# EAGLE design Y187 (EAGLE 6.6.0)

## Sheet 1 of 2
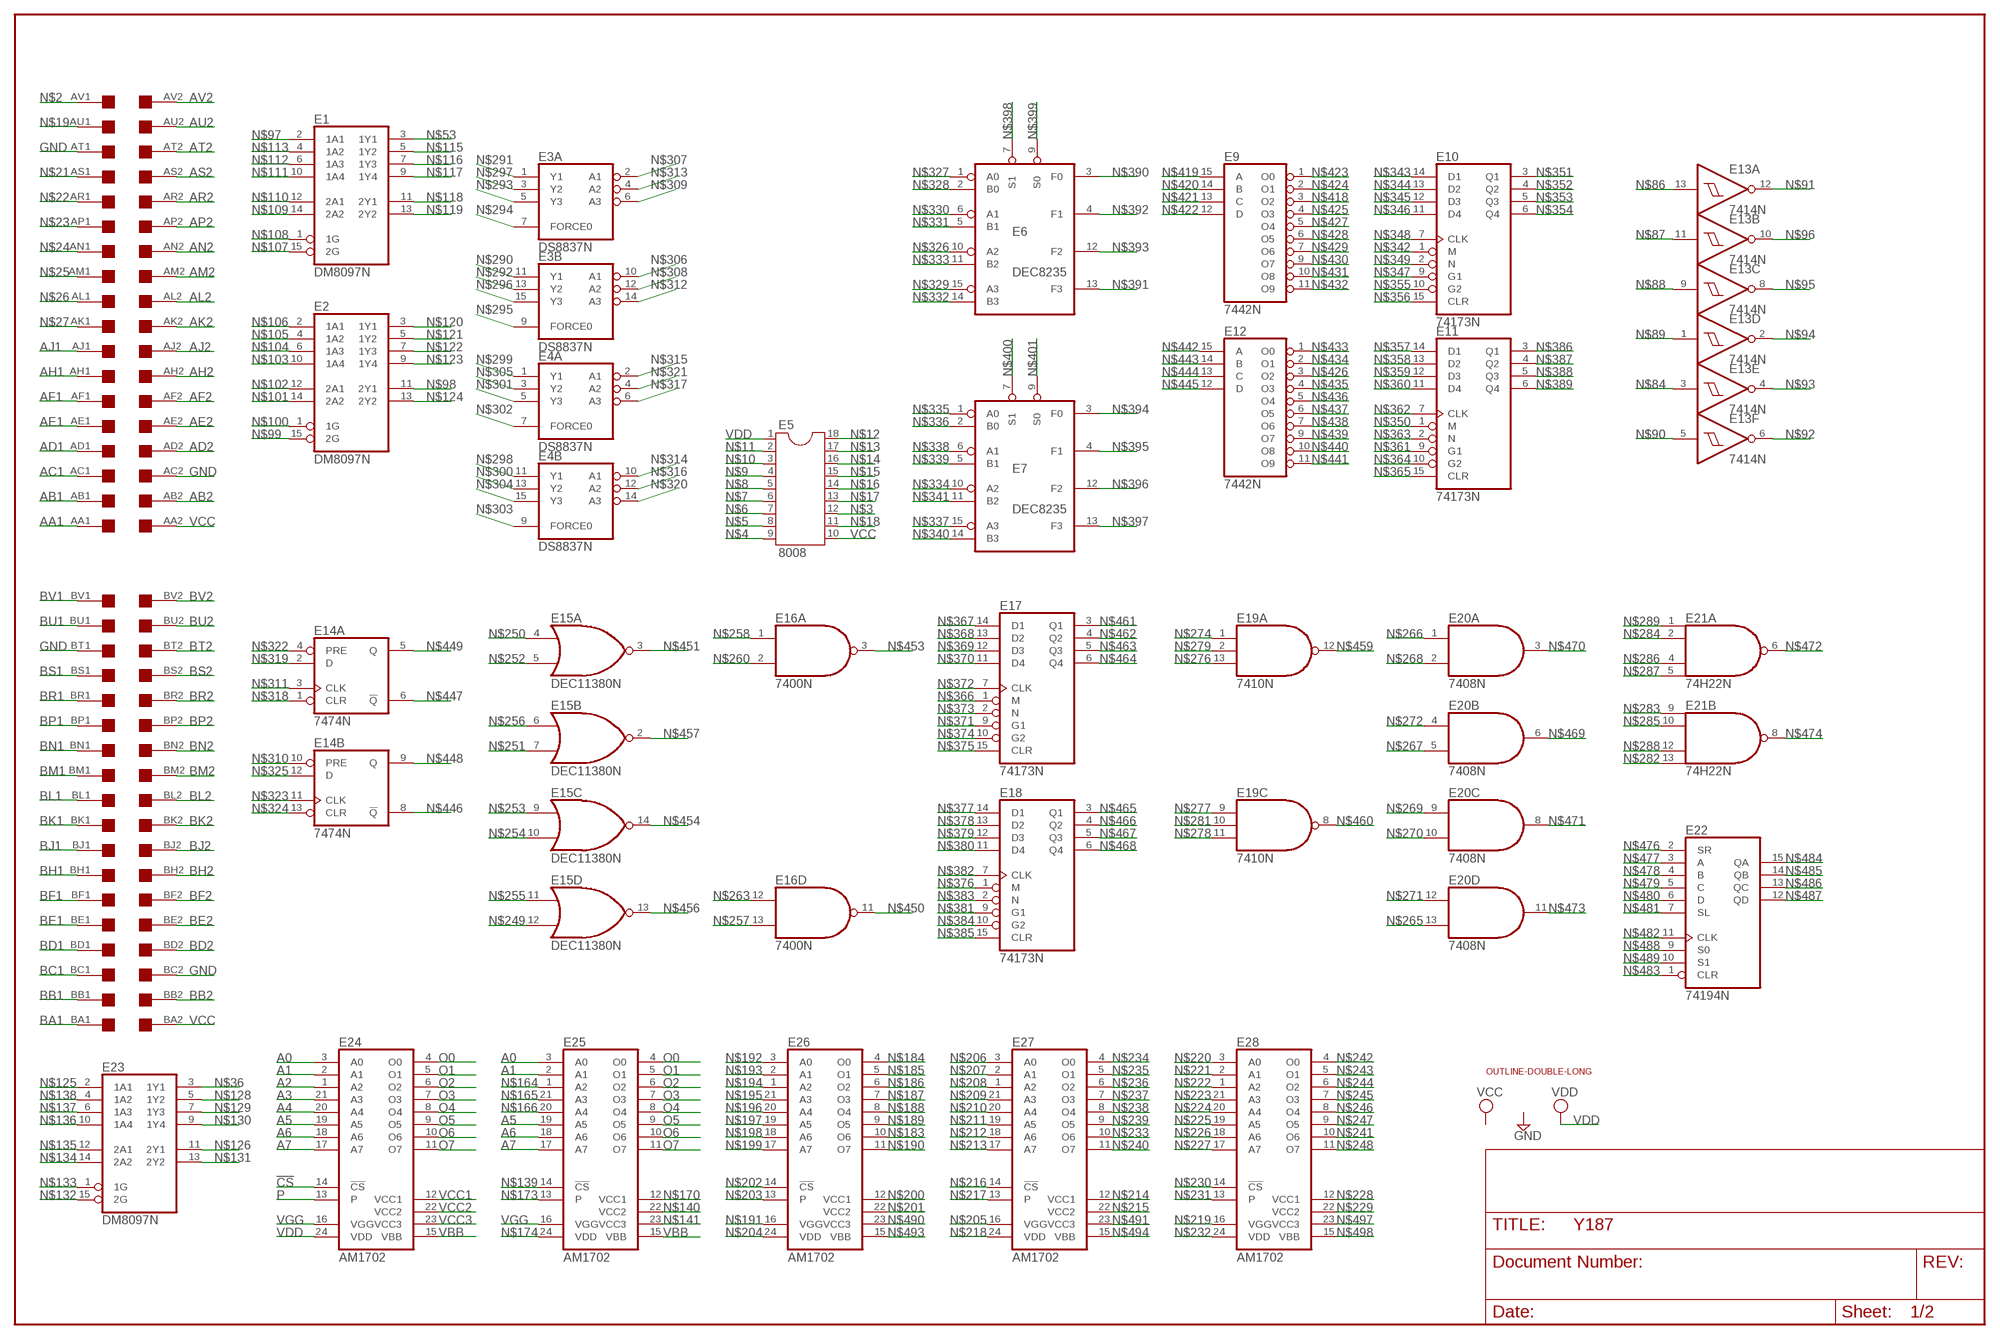
[diagram p0: schematic, sheet 1]

### Parts
E1  DM8097N  74367N  [DIL16]
E2  DM8097N  74367N  [DIL16]
E3  DS8837N  [DIL16]
E4  DS8837N  [DIL16]
E5  8008  DIL18  [DIL18]
E6  DEC8235  [DIL16]
E7  DEC8235  [DIL16]
E9  7442N  74LS42N  [DIL16]
E10  74173N  74LS173N  [DIL16]
E11  74173N  74LS173N  [DIL16]
E12  7442N  74LS42N  [DIL16]
E13  7414N  [DIL14]
E14  7474N  74S74N  [DIL14]
E15  DEC11380N  SP380N  [DIL14]
E16  7400N  [DIL14]
E17  74173N  74LS173N  [DIL16]
E18  74173N  74LS173N  [DIL16]
E19  7410N  [DIL14]
E20  7408N  74LS08N  [DIL14]
E21  74H22N  7422N  [DIL14]
E22  74194N  74LS194N  [DIL16]
E23  DM8097N  74367N  [DIL16]
E24  AM1702  [DIL24]
E25  AM1702  [DIL24]
E26  AM1702  [DIL24]
E27  AM1702  [DIL24]
E28  AM1702  [DIL24]
U$1  OUTLINE-DOUBLE-LONG  [DOUBLE-LONG]
U$2  DOUBLE  [EDGE-CON4]

### Nets
!CS: E24.14(!CS)
A0: E24.3(A0) E25.3(A0)
A1: E24.2(A1) E25.2(A1)
A2: E24.1(A2)
A3: E24.21(A3)
A4: E24.20(A4)
A5: E24.19(A5) E25.19(A5)
A6: E24.18(A6) E25.18(A6)
A7: E24.17(A7) E25.17(A7)
AA1: U$2.AA1
AB1: U$2.AB1
AB2: U$2.AB2
AC1: U$2.AC1
AD1: U$2.AD1
AD2: U$2.AD2
AE1: U$2.AE1
AE2: U$2.AE2
AF1: U$2.AF1
AF2: U$2.AF2
AH1: U$2.AH1
AH2: U$2.AH2
AJ1: U$2.AJ1
AJ2: U$2.AJ2
AK2: U$2.AK2
AL2: U$2.AL2
AM2: U$2.AM2
AN2: U$2.AN2
AP2: U$2.AP2
AR2: U$2.AR2
AS2: U$2.AS2
AT2: U$2.AT2
AU2: U$2.AU2
AV2: U$2.AV2
BA1: U$2.BA1
BB1: U$2.BB1
BB2: U$2.BB2
BC1: U$2.BC1
BD1: U$2.BD1
BD2: U$2.BD2
BE1: U$2.BE1
BE2: U$2.BE2
BF1: U$2.BF1
BF2: U$2.BF2
BH1: U$2.BH1
BH2: U$2.BH2
BJ1: U$2.BJ1
BJ2: U$2.BJ2
BK1: U$2.BK1
BK2: U$2.BK2
BL1: U$2.BL1
BL2: U$2.BL2
BM1: U$2.BM1
BM2: U$2.BM2
BN1: U$2.BN1
BN2: U$2.BN2
BP1: U$2.BP1
BP2: U$2.BP2
BR1: U$2.BR1
BR2: U$2.BR2
BS1: U$2.BS1 ; also sheet 2
BS2: U$2.BS2
BT2: U$2.BT2
BU1: U$2.BU1 ; also sheet 2
BU2: U$2.BU2
BV1: U$2.BV1 ; also sheet 2
BV2: U$2.BV2
GND [Supply]: U$2.AC2 U$2.AT1 U$2.BC2 U$2.BT1 ; also sheet 2
N$2: U$2.AV1
N$3: E5.12
N$4: E5.9
N$5: E5.8
N$6: E5.7
N$7: E5.6
N$8: E5.5
N$9: E5.4
N$10: E5.3
N$11: E5.2
N$12: E5.18
N$13: E5.17
N$14: E5.16
N$15: E5.15
N$16: E5.14
N$17: E5.13
N$18: E5.11
N$19: U$2.AU1
N$21: U$2.AS1
N$22: U$2.AR1
N$23: U$2.AP1
N$24: U$2.AN1
N$25: U$2.AM1
N$26: U$2.AL1
N$27: U$2.AK1
N$36: E23.3(1Y1)
N$53: E1.3(1Y1)
N$84: E13.3(E:I)
N$86: E13.13(A:I)
N$87: E13.11(B:I)
N$88: E13.9(C:I)
N$89: E13.1(D:I)
N$90: E13.5(F:I)
N$91: E13.12(A:O)
N$92: E13.6(F:O)
N$93: E13.4(E:O)
N$94: E13.2(D:O)
N$95: E13.8(C:O)
N$96: E13.10(B:O)
N$97: E1.2(1A1)
N$98: E2.11(2Y1)
N$99: E2.15(2G)
N$100: E2.1(1G)
N$101: E2.14(2A2)
N$102: E2.12(2A1)
N$103: E2.10(1A4)
N$104: E2.6(1A3)
N$105: E2.4(1A2)
N$106: E2.2(1A1)
N$107: E1.15(2G)
N$108: E1.1(1G)
N$109: E1.14(2A2)
N$110: E1.12(2A1)
N$111: E1.10(1A4)
N$112: E1.6(1A3)
N$113: E1.4(1A2)
N$115: E1.5(1Y2)
N$116: E1.7(1Y3)
N$117: E1.9(1Y4)
N$118: E1.11(2Y1)
N$119: E1.13(2Y2)
N$120: E2.3(1Y1)
N$121: E2.5(1Y2)
N$122: E2.7(1Y3)
N$123: E2.9(1Y4)
N$124: E2.13(2Y2)
N$125: E23.2(1A1)
N$126: E23.11(2Y1)
N$128: E23.5(1Y2)
N$129: E23.7(1Y3)
N$130: E23.9(1Y4)
N$131: E23.13(2Y2)
N$132: E23.15(2G)
N$133: E23.1(1G)
N$134: E23.14(2A2)
N$135: E23.12(2A1)
N$136: E23.10(1A4)
N$137: E23.6(1A3)
N$138: E23.4(1A2)
N$139: E25.14(!CS)
N$140: E25.22(VCC2)
N$141: E25.23(VCC3)
N$164: E25.1(A2)
N$165: E25.21(A3)
N$166: E25.20(A4)
N$170: E25.12(VCC1)
N$173: E25.13(P)
N$174: E25.24(VDD)
N$183: E26.10(O6)
N$184: E26.4(O0)
N$185: E26.5(O1)
N$186: E26.6(O2)
N$187: E26.7(O3)
N$188: E26.8(O4)
N$189: E26.9(O5)
N$190: E26.11(O7)
N$191: E26.16(VGG)
N$192: E26.3(A0)
N$193: E26.2(A1)
N$194: E26.1(A2)
N$195: E26.21(A3)
N$196: E26.20(A4)
N$197: E26.19(A5)
N$198: E26.18(A6)
N$199: E26.17(A7)
N$200: E26.12(VCC1)
N$201: E26.22(VCC2)
N$202: E26.14(!CS)
N$203: E26.13(P)
N$204: E26.24(VDD)
N$205: E27.16(VGG)
N$206: E27.3(A0)
N$207: E27.2(A1)
N$208: E27.1(A2)
N$209: E27.21(A3)
N$210: E27.20(A4)
N$211: E27.19(A5)
N$212: E27.18(A6)
N$213: E27.17(A7)
N$214: E27.12(VCC1)
N$215: E27.22(VCC2)
N$216: E27.14(!CS)
N$217: E27.13(P)
N$218: E27.24(VDD)
N$219: E28.16(VGG)
N$220: E28.3(A0)
N$221: E28.2(A1)
N$222: E28.1(A2)
N$223: E28.21(A3)
N$224: E28.20(A4)
N$225: E28.19(A5)
N$226: E28.18(A6)
N$227: E28.17(A7)
N$228: E28.12(VCC1)
N$229: E28.22(VCC2)
N$230: E28.14(!CS)
N$231: E28.13(P)
N$232: E28.24(VDD)
N$233: E27.10(O6)
N$234: E27.4(O0)
N$235: E27.5(O1)
N$236: E27.6(O2)
N$237: E27.7(O3)
N$238: E27.8(O4)
N$239: E27.9(O5)
N$240: E27.11(O7)
N$241: E28.10(O6)
N$242: E28.4(O0)
N$243: E28.5(O1)
N$244: E28.6(O2)
N$245: E28.7(O3)
N$246: E28.8(O4)
N$247: E28.9(O5)
N$248: E28.11(O7)
N$249: E15.12(D:I1)
N$250: E15.4(A:I0)
N$251: E15.7(B:I1)
N$252: E15.5(A:I1)
N$253: E15.9(C:I0)
N$254: E15.10(C:I1)
N$255: E15.11(D:I0)
N$256: E15.6(B:I0)
N$257: E16.13(D:I1)
N$258: E16.1(A:I0)
N$260: E16.2(A:I1)
N$263: E16.12(D:I0)
N$265: E20.13(D:I1)
N$266: E20.1(A:I0)
N$267: E20.5(B:I1)
N$268: E20.2(A:I1)
N$269: E20.9(C:I0)
N$270: E20.10(C:I1)
N$271: E20.12(D:I0)
N$272: E20.4(B:I0)
N$274: E19.1(A:I0)
N$276: E19.13(A:I2)
N$277: E19.9(C:I0)
N$278: E19.11(C:I2)
N$279: E19.2(A:I1)
N$281: E19.10(C:I1)
N$282: E21.13(B:I3)
N$283: E21.9(B:I0)
N$284: E21.2(A:I1)
N$285: E21.10(B:I1)
N$286: E21.4(A:I2)
N$287: E21.5(A:I3)
N$288: E21.12(B:I2)
N$289: E21.1(A:I0)
N$290: E3.11(B:Y1)
N$291: E3.1(A:Y1)
N$292: E3.13(B:Y2)
N$293: E3.5(A:Y3)
N$294: E3.7(A:FORCE0)
N$295: E3.9(B:FORCE0)
N$296: E3.15(B:Y3)
N$297: E3.3(A:Y2)
N$298: E4.11(B:Y1)
N$299: E4.1(A:Y1)
N$300: E4.13(B:Y2)
N$301: E4.5(A:Y3)
N$302: E4.7(A:FORCE0)
N$303: E4.9(B:FORCE0)
N$304: E4.15(B:Y3)
N$305: E4.3(A:Y2)
N$306: E3.10(B:A1)
N$307: E3.2(A:A1)
N$308: E3.12(B:A2)
N$309: E3.6(A:A3)
N$310: E14.10(B:PRE)
N$311: E14.3(A:CLK)
N$312: E3.14(B:A3)
N$313: E3.4(A:A2)
N$314: E4.10(B:A1)
N$315: E4.2(A:A1)
N$316: E4.12(B:A2)
N$317: E4.6(A:A3)
N$318: E14.1(A:CLR)
N$319: E14.2(A:D)
N$320: E4.14(B:A3)
N$321: E4.4(A:A2)
N$322: E14.4(A:PRE)
N$323: E14.11(B:CLK)
N$324: E14.13(B:CLR)
N$325: E14.12(B:D)
N$326: E6.10(A2)
N$327: E6.1(A0)
N$328: E6.2(B0)
N$329: E6.15(A3)
N$330: E6.6(A1)
N$331: E6.5(B1)
N$332: E6.14(B3)
N$333: E6.11(B2)
N$334: E7.10(A2)
N$335: E7.1(A0)
N$336: E7.2(B0)
N$337: E7.15(A3)
N$338: E7.6(A1)
N$339: E7.5(B1)
N$340: E7.14(B3)
N$341: E7.11(B2)
N$342: E10.1(M)
N$343: E10.14(D1)
N$344: E10.13(D2)
N$345: E10.12(D3)
N$346: E10.11(D4)
N$347: E10.9(G1)
N$348: E10.7(CLK)
N$349: E10.2(N)
N$350: E11.1(M)
N$351: E10.3(Q1)
N$352: E10.4(Q2)
N$353: E10.5(Q3)
N$354: E10.6(Q4)
N$355: E10.10(G2)
N$356: E10.15(CLR)
N$357: E11.14(D1)
N$358: E11.13(D2)
N$359: E11.12(D3)
N$360: E11.11(D4)
N$361: E11.9(G1)
N$362: E11.7(CLK)
N$363: E11.2(N)
N$364: E11.10(G2)
N$365: E11.15(CLR)
N$366: E17.1(M)
N$367: E17.14(D1)
N$368: E17.13(D2)
N$369: E17.12(D3)
N$370: E17.11(D4)
N$371: E17.9(G1)
N$372: E17.7(CLK)
N$373: E17.2(N)
N$374: E17.10(G2)
N$375: E17.15(CLR)
N$376: E18.1(M)
N$377: E18.14(D1)
N$378: E18.13(D2)
N$379: E18.12(D3)
N$380: E18.11(D4)
N$381: E18.9(G1)
N$382: E18.7(CLK)
N$383: E18.2(N)
N$384: E18.10(G2)
N$385: E18.15(CLR)
N$386: E11.3(Q1)
N$387: E11.4(Q2)
N$388: E11.5(Q3)
N$389: E11.6(Q4)
N$390: E6.3(F0)
N$391: E6.13(F3)
N$392: E6.4(F1)
N$393: E6.12(F2)
N$394: E7.3(F0)
N$395: E7.4(F1)
N$396: E7.12(F2)
N$397: E7.13(F3)
N$398: E6.7(S1)
N$399: E6.9(S0)
N$400: E7.7(S1)
N$401: E7.9(S0)
N$418: E9.3(O2)
N$419: E9.15(A)
N$420: E9.14(B)
N$421: E9.13(C)
N$422: E9.12(D)
N$423: E9.1(O0)
N$424: E9.2(O1)
N$425: E9.4(O3)
N$426: E12.3(O2)
N$427: E9.5(O4)
N$428: E9.6(O5)
N$429: E9.7(O6)
N$430: E9.9(O7)
N$431: E9.10(O8)
N$432: E9.11(O9)
N$433: E12.1(O0)
N$434: E12.2(O1)
N$435: E12.4(O3)
N$436: E12.5(O4)
N$437: E12.6(O5)
N$438: E12.7(O6)
N$439: E12.9(O7)
N$440: E12.10(O8)
N$441: E12.11(O9)
N$442: E12.15(A)
N$443: E12.14(B)
N$444: E12.13(C)
N$445: E12.12(D)
N$446: E14.8(B:!Q)
N$447: E14.6(A:!Q)
N$448: E14.9(B:Q)
N$449: E14.5(A:Q)
N$450: E16.11(D:O)
N$451: E15.3(A:O)
N$453: E16.3(A:O)
N$454: E15.14(C:O)
N$456: E15.13(D:O)
N$457: E15.2(B:O)
N$459: E19.12(A:O)
N$460: E19.8(C:O)
N$461: E17.3(Q1)
N$462: E17.4(Q2)
N$463: E17.5(Q3)
N$464: E17.6(Q4)
N$465: E18.3(Q1)
N$466: E18.4(Q2)
N$467: E18.5(Q3)
N$468: E18.6(Q4)
N$469: E20.6(B:O)
N$470: E20.3(A:O)
N$471: E20.8(C:O)
N$472: E21.6(A:O)
N$473: E20.11(D:O)
N$474: E21.8(B:O)
N$476: E22.2(SR)
N$477: E22.3(A)
N$478: E22.4(B)
N$479: E22.5(C)
N$480: E22.6(D)
N$481: E22.7(SL)
N$482: E22.11(CLK)
N$483: E22.1(CLR)
N$484: E22.15(QA)
N$485: E22.14(QB)
N$486: E22.13(QC)
N$487: E22.12(QD)
N$488: E22.9(S0)
N$489: E22.10(S1)
N$490: E26.23(VCC3)
N$491: E27.23(VCC3)
N$493: E26.15(VBB)
N$494: E27.15(VBB)
N$497: E28.23(VCC3)
N$498: E28.15(VBB)
O0: E24.4(O0) E25.4(O0)
O1: E24.5(O1) E25.5(O1)
O2: E24.6(O2) E25.6(O2)
O3: E24.7(O3) E25.7(O3)
O4: E24.8(O4) E25.8(O4)
O5: E24.9(O5) E25.9(O5)
O6: E24.10(O6) E25.10(O6)
O7: E24.11(O7) E25.11(O7)
P: E24.13(P)
VBB: E24.15(VBB) E25.15(VBB)
VCC [Supply]: E5.10 U$2.AA2 U$2.BA2 ; also sheet 2
VCC1: E24.12(VCC1)
VCC2: E24.22(VCC2)
VCC3: E24.23(VCC3)
VDD: E5.1 E24.24(VDD)
VGG: E24.16(VGG) E25.16(VGG)

## Sheet 2 of 2
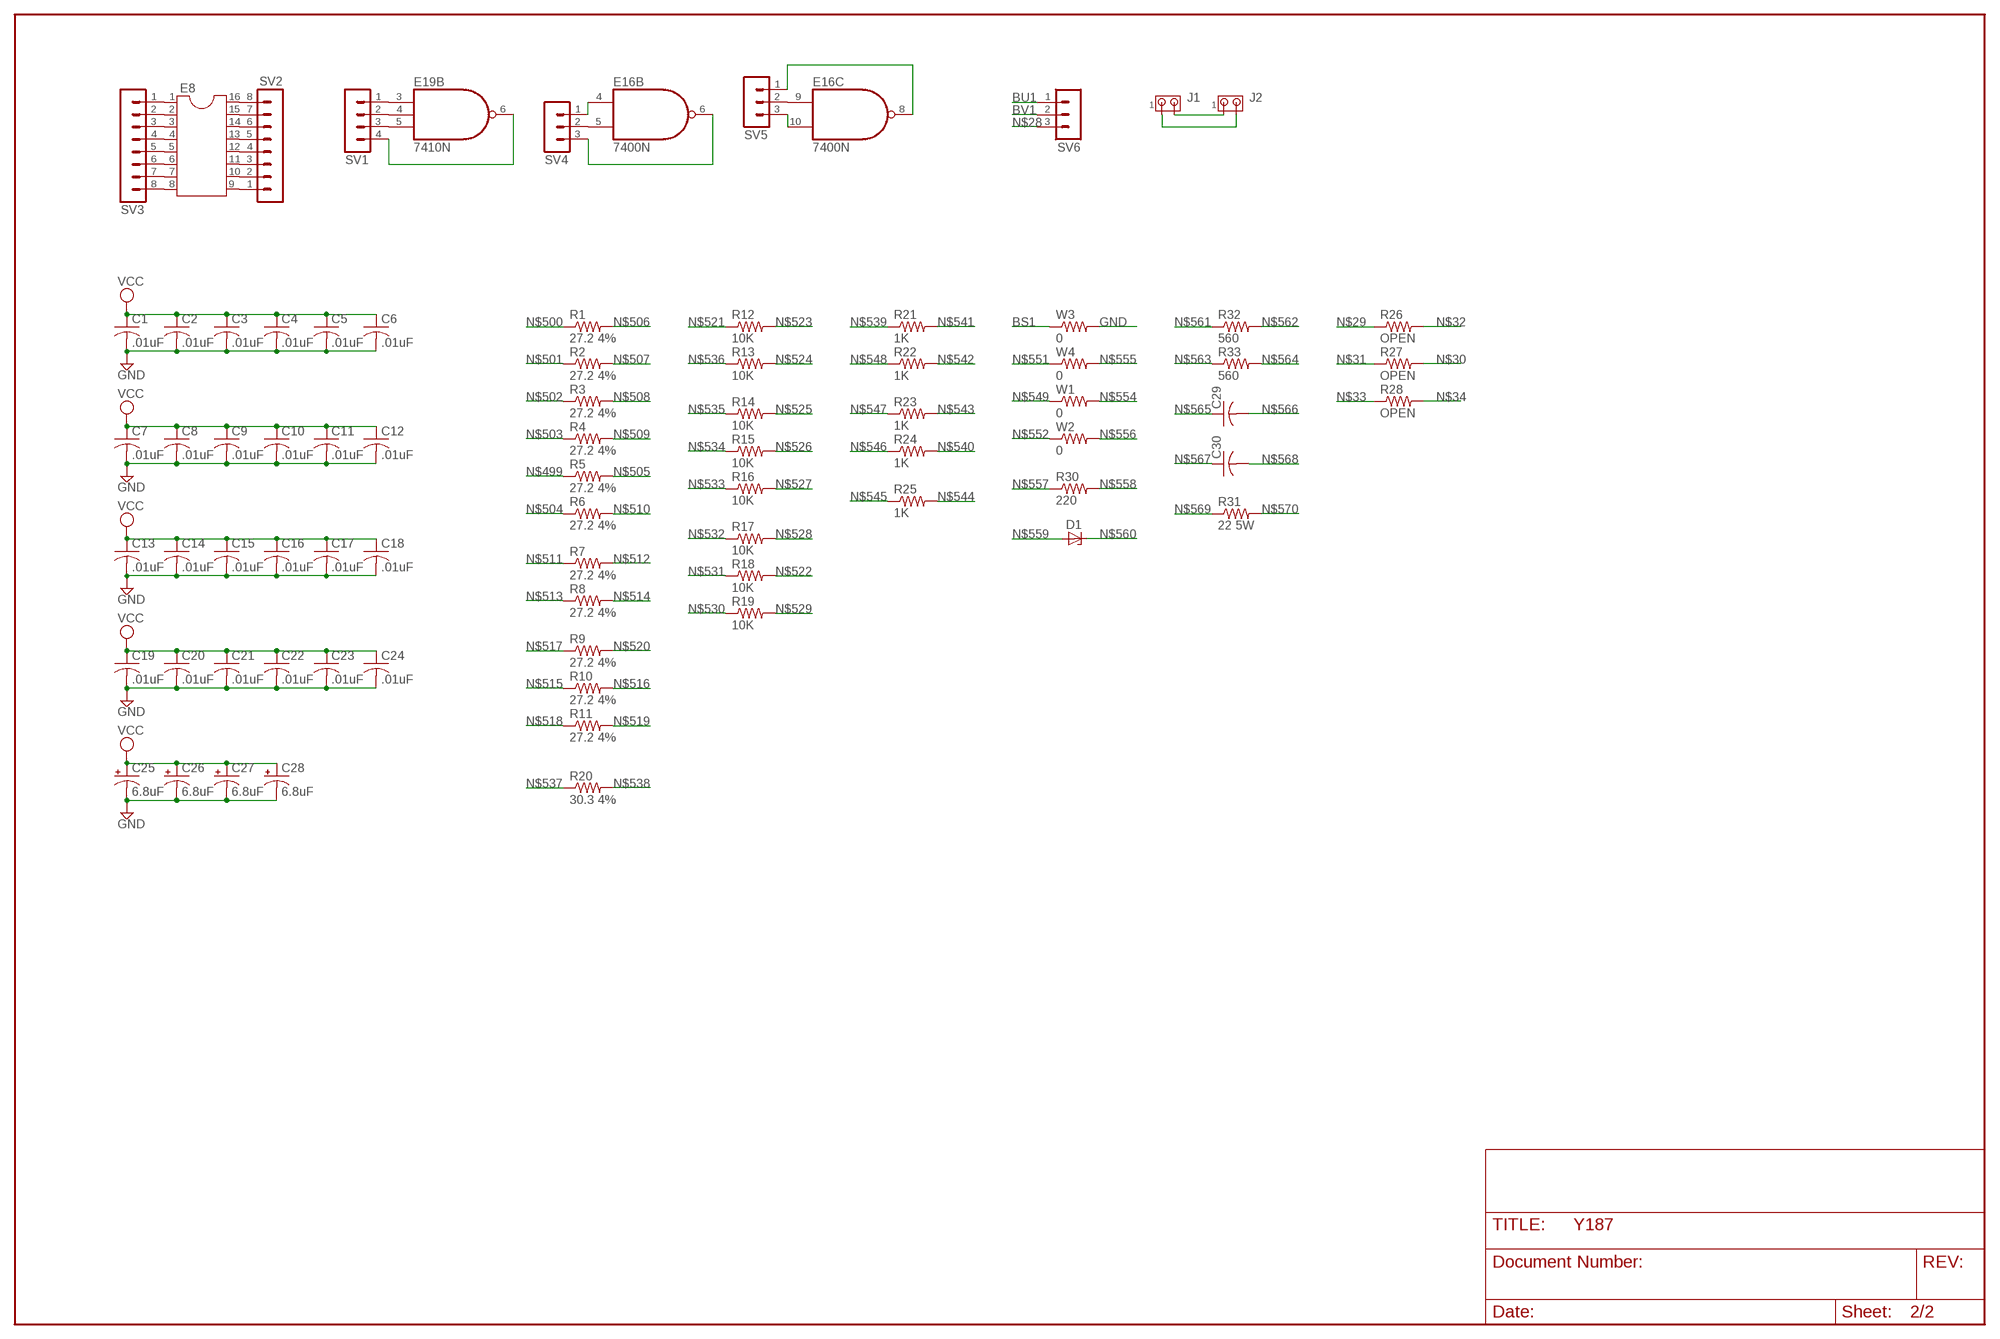
[diagram p1: schematic, sheet 2]

### Parts
C1  .01uF  C-US075-032X103  [C075-032X103]
C2  .01uF  C-US075-032X103  [C075-032X103]
C3  .01uF  C-US075-032X103  [C075-032X103]
C4  .01uF  C-US075-032X103  [C075-032X103]
C5  .01uF  C-US075-032X103  [C075-032X103]
C6  .01uF  C-US075-032X103  [C075-032X103]
C7  .01uF  C-US075-032X103  [C075-032X103]
C8  .01uF  C-US075-032X103  [C075-032X103]
C9  .01uF  C-US075-032X103  [C075-032X103]
C10  .01uF  C-US075-032X103  [C075-032X103]
C11  .01uF  C-US075-032X103  [C075-032X103]
C12  .01uF  C-US075-032X103  [C075-032X103]
C13  .01uF  C-US075-032X103  [C075-032X103]
C14  .01uF  C-US075-032X103  [C075-032X103]
C15  .01uF  C-US075-032X103  [C075-032X103]
C16  .01uF  C-US075-032X103  [C075-032X103]
C17  .01uF  C-US075-032X103  [C075-032X103]
C18  .01uF  C-US075-032X103  [C075-032X103]
C19  .01uF  C-US075-032X103  [C075-032X103]
C20  .01uF  C-US075-032X103  [C075-032X103]
C21  .01uF  C-US075-032X103  [C075-032X103]
C22  .01uF  C-US075-032X103  [C075-032X103]
C23  .01uF  C-US075-032X103  [C075-032X103]
C24  .01uF  C-US075-032X103  [C075-032X103]
C25  6.8uF  CPOL-USE20-8AXIAL  [E12-8]
C26  6.8uF  CPOL-USE20-8AXIAL  [E12-8]
C27  6.8uF  CPOL-USE20-8AXIAL  [E12-8]
C28  6.8uF  CPOL-USE20-8AXIAL  [E12-8]
C29  C-US075-032X103  [C075-032X103]
C30  C-US075-032X103  [C075-032X103]
D1  ZENER-DIODEDO35Z10  [DO35Z10]
E8  DIL16  [DIL16]
J1  MTA02-100  [10X02MTA]
J2  MTA02-100  [10X02MTA]
R1  27.2 4%  R-US_0207/10  [0207/10]
R2  27.2 4%  R-US_0207/10  [0207/10]
R3  27.2 4%  R-US_0207/10  [0207/10]
R4  27.2 4%  R-US_0207/10  [0207/10]
R5  27.2 4%  R-US_0207/10  [0207/10]
R6  27.2 4%  R-US_0207/10  [0207/10]
R7  27.2 4%  R-US_0207/10  [0207/10]
R8  27.2 4%  R-US_0207/10  [0207/10]
R9  27.2 4%  R-US_0207/10  [0207/10]
R10  27.2 4%  R-US_0207/10  [0207/10]
R11  27.2 4%  R-US_0207/10  [0207/10]
R12  10K  R-US_0207/10  [0207/10]
R13  10K  R-US_0207/10  [0207/10]
R14  10K  R-US_0207/10  [0207/10]
R15  10K  R-US_0207/10  [0207/10]
R16  10K  R-US_0207/10  [0207/10]
R17  10K  R-US_0207/10  [0207/10]
R18  10K  R-US_0207/10  [0207/10]
R19  10K  R-US_0207/10  [0207/10]
R20  30.3 4%  R-US_0207/10  [0207/10]
R21  1K  R-US_0207/10  [0207/10]
R22  1K  R-US_0207/10  [0207/10]
R23  1K  R-US_0207/10  [0207/10]
R24  1K  R-US_0207/10  [0207/10]
R25  1K  R-US_0207/10  [0207/10]
R26  OPEN  R-US_0207/10  [0207/10]
R27  OPEN  R-US_0207/10  [0207/10]
R28  OPEN  R-US_0207/10  [0207/10]
R30  220  R-US_0207/10  [0207/10]
R31  22 5W  R-US_0617/22  [0617/22]
R32  560  R-US_0207/10  [0207/10]
R33  560  R-US_0207/10  [0207/10]
SV1  MA04-1  [MA04-1]
SV2  MA08-1  [MA08-1]
SV3  MA08-1  [MA08-1]
SV4  MA03-1  [MA03-1]
SV5  MA03-1  [MA03-1]
SV6  MA03-1  [MA03-1]
W1  0  R-US_0207/10  [0207/10]
W2  0  R-US_0207/10  [0207/10]
W3  0  R-US_0207/10  [0207/10]
W4  0  R-US_0207/10  [0207/10]

### Nets
BS1: W3.1 ; also sheet 1
BU1: SV6.1 ; also sheet 1
BV1: SV6.2 ; also sheet 1
GND [Supply]: C1.2 C2.2 C3.2 C4.2 C5.2 C6.2 C7.2 C8.2 C9.2 C10.2 C11.2 C12.2 C13.2 C14.2 C15.2 C16.2 C17.2 C18.2 C19.2 C20.2 C21.2 C22.2 C23.2 C24.2 C25.- C26.- C27.- C28.- W3.2 ; also sheet 1
N$1: J1.2 J2.1
N$20: J1.1 J2.2
N$28: SV6.3
N$29: R26.1
N$30: R27.2
N$31: R27.1
N$32: R26.2
N$33: R28.1
N$34: R28.2
N$259: E16.5(B:I1) SV4.2
N$261: E16.4(B:I0) SV4.1
N$262: E16.9(C:I0) SV5.2
N$264: E16.10(C:I1) SV5.3
N$273: E19.3(B:I0) SV1.1
N$275: E19.4(B:I1) SV1.2
N$280: E19.5(B:I2) SV1.3
N$402: E8.1 SV3.1
N$403: E8.2 SV3.2
N$404: E8.3 SV3.3
N$405: E8.4 SV3.4
N$406: E8.5 SV3.5
N$407: E8.6 SV3.6
N$408: E8.7 SV3.7
N$409: E8.8 SV3.8
N$410: E8.9 SV2.1
N$411: E8.10 SV2.2
N$412: E8.11 SV2.3
N$413: E8.12 SV2.4
N$414: E8.13 SV2.5
N$415: E8.14 SV2.6
N$416: E8.15 SV2.7
N$417: E8.16 SV2.8
N$452: E16.6(B:O) SV4.3
N$455: E16.8(C:O) SV5.1
N$458: E19.6(B:O) SV1.4
N$499: R5.1
N$500: R1.1
N$501: R2.1
N$502: R3.1
N$503: R4.1
N$504: R6.1
N$505: R5.2
N$506: R1.2
N$507: R2.2
N$508: R3.2
N$509: R4.2
N$510: R6.2
N$511: R7.1
N$512: R7.2
N$513: R8.1
N$514: R8.2
N$515: R10.1
N$516: R10.2
N$517: R9.1
N$518: R11.1
N$519: R11.2
N$520: R9.2
N$521: R12.1
N$522: R18.2
N$523: R12.2
N$524: R13.2
N$525: R14.2
N$526: R15.2
N$527: R16.2
N$528: R17.2
N$529: R19.2
N$530: R19.1
N$531: R18.1
N$532: R17.1
N$533: R16.1
N$534: R15.1
N$535: R14.1
N$536: R13.1
N$537: R20.1
N$538: R20.2
N$539: R21.1
N$540: R24.2
N$541: R21.2
N$542: R22.2
N$543: R23.2
N$544: R25.2
N$545: R25.1
N$546: R24.1
N$547: R23.1
N$548: R22.1
N$549: W1.1
N$551: W4.1
N$552: W2.1
N$554: W1.2
N$555: W4.2
N$556: W2.2
N$557: R30.1
N$558: R30.2
N$559: D1.A
N$560: D1.C
N$561: R32.1
N$562: R32.2
N$563: R33.1
N$564: R33.2
N$565: C29.1
N$566: C29.2
N$567: C30.1
N$568: C30.2
N$569: R31.1
N$570: R31.2
VCC [Supply]: C1.1 C2.1 C3.1 C4.1 C5.1 C6.1 C7.1 C8.1 C9.1 C10.1 C11.1 C12.1 C13.1 C14.1 C15.1 C16.1 C17.1 C18.1 C19.1 C20.1 C21.1 C22.1 C23.1 C24.1 C25.+ C26.+ C27.+ C28.+ ; also sheet 1

## Power pins joined to a net without a drawn wire
GND: E1.8(GND) E2.8(GND) E3.8(P:GND) E4.8(P:GND) E6.8(GND) E7.8(GND) E9.8(GND) E10.8(GND) E11.8(GND) E12.8(GND) E13.7(P:GND) E14.7(P:GND) E15.1(P:GND) E16.7(P:GND) E17.8(GND) E18.8(GND) E19.7(P:GND) E20.7(P:GND) E21.7(P:GND) E22.8(GND) E23.8(GND)
VCC: E1.16(VCC) E2.16(VCC) E3.16(P:VCC) E4.16(P:VCC) E6.16(VCC) E7.16(VCC) E9.16(VCC) E10.16(VCC) E11.16(VCC) E12.16(VCC) E13.14(P:VCC) E14.14(P:VCC) E15.8(P:VCC) E16.14(P:VCC) E17.16(VCC) E18.16(VCC) E19.14(P:VCC) E20.14(P:VCC) E21.14(P:VCC) E22.16(VCC) E23.16(VCC)

## Library data of the parts
C1-C24 C29 C30 = rcl:C-US: CAPACITOR, American symbol
C25-C28 = dec-con:CPOL-USE20-8AXIAL: A 0.8 inch electrolytic.
D1 = diode:ZENER-DIODE: Z-Diode
E1 E2 E23 = 74xx-us:74*367: Hex BUS DRIVER, 3-state
E3 E4 = dec-con:DS8837: Hex inverting LINE RECEIVER
E5 = ic-package:DIL18: Dual In Line / Socket
E6 E7 = dec-con:DEC8235: 4-bit data selector
E8 = ic-package:DIL16: Dual In Line / Socket
E9 E12 = 74xx-us:74*42: 4-line to 10-line DECODER (1-of-10)
E10 E11 E17 E18 = 74xx-us:74*173: 4-bit D type REGISTER, 3-state
E13 = 74xx-us:74*14: Hex schmitt trigger INVERTER
E14 = 74xx-us:74*74: Dual D type positive edge triggered FLIP FLOP, preset and clear
E15 = dec-con:SP380: Quad NOR gate (use 8640)
E16 = 74xx-us:74*00: Quad 2-input NAND gate
E19 = 74xx-us:74*10: Triple 3-input NAND gate
E20 = 74xx-us:74*08: Quad 2-input AND gate
E21 = 74xx-us:74*22: Dual 4-input NAND gate, open collector
E22 = 74xx-us:74*194: 4-bit bidirectional SHIFT REGISTER
E24-E28 = dec-con:AM1702: 256x8 EPROM
J1 J2 = con-amp:MTA02-100: AMP connector
R1-R28 R30-R33 W1-W4 = rcl:R-US_: RESISTOR, American symbol
SV1 = con-lstb:MA04-1: PIN HEADER; OC_FARNELL: unknown; OC_NEWARK: unknown
SV2 SV3 = con-lstb:MA08-1: PIN HEADER; OC_FARNELL: unknown; OC_NEWARK: unknown
SV4-SV6 = con-lstb:MA03-1: PIN HEADER; OC_FARNELL: unknown; OC_NEWARK: unknown
U$1 = dec-con:OUTLINE-*: Board outlines for DEC boards.
U$2 = dec-con:DOUBLE: Double-Height DEC board

## Net classes
1 Supply: width 0.813 mm

## Board
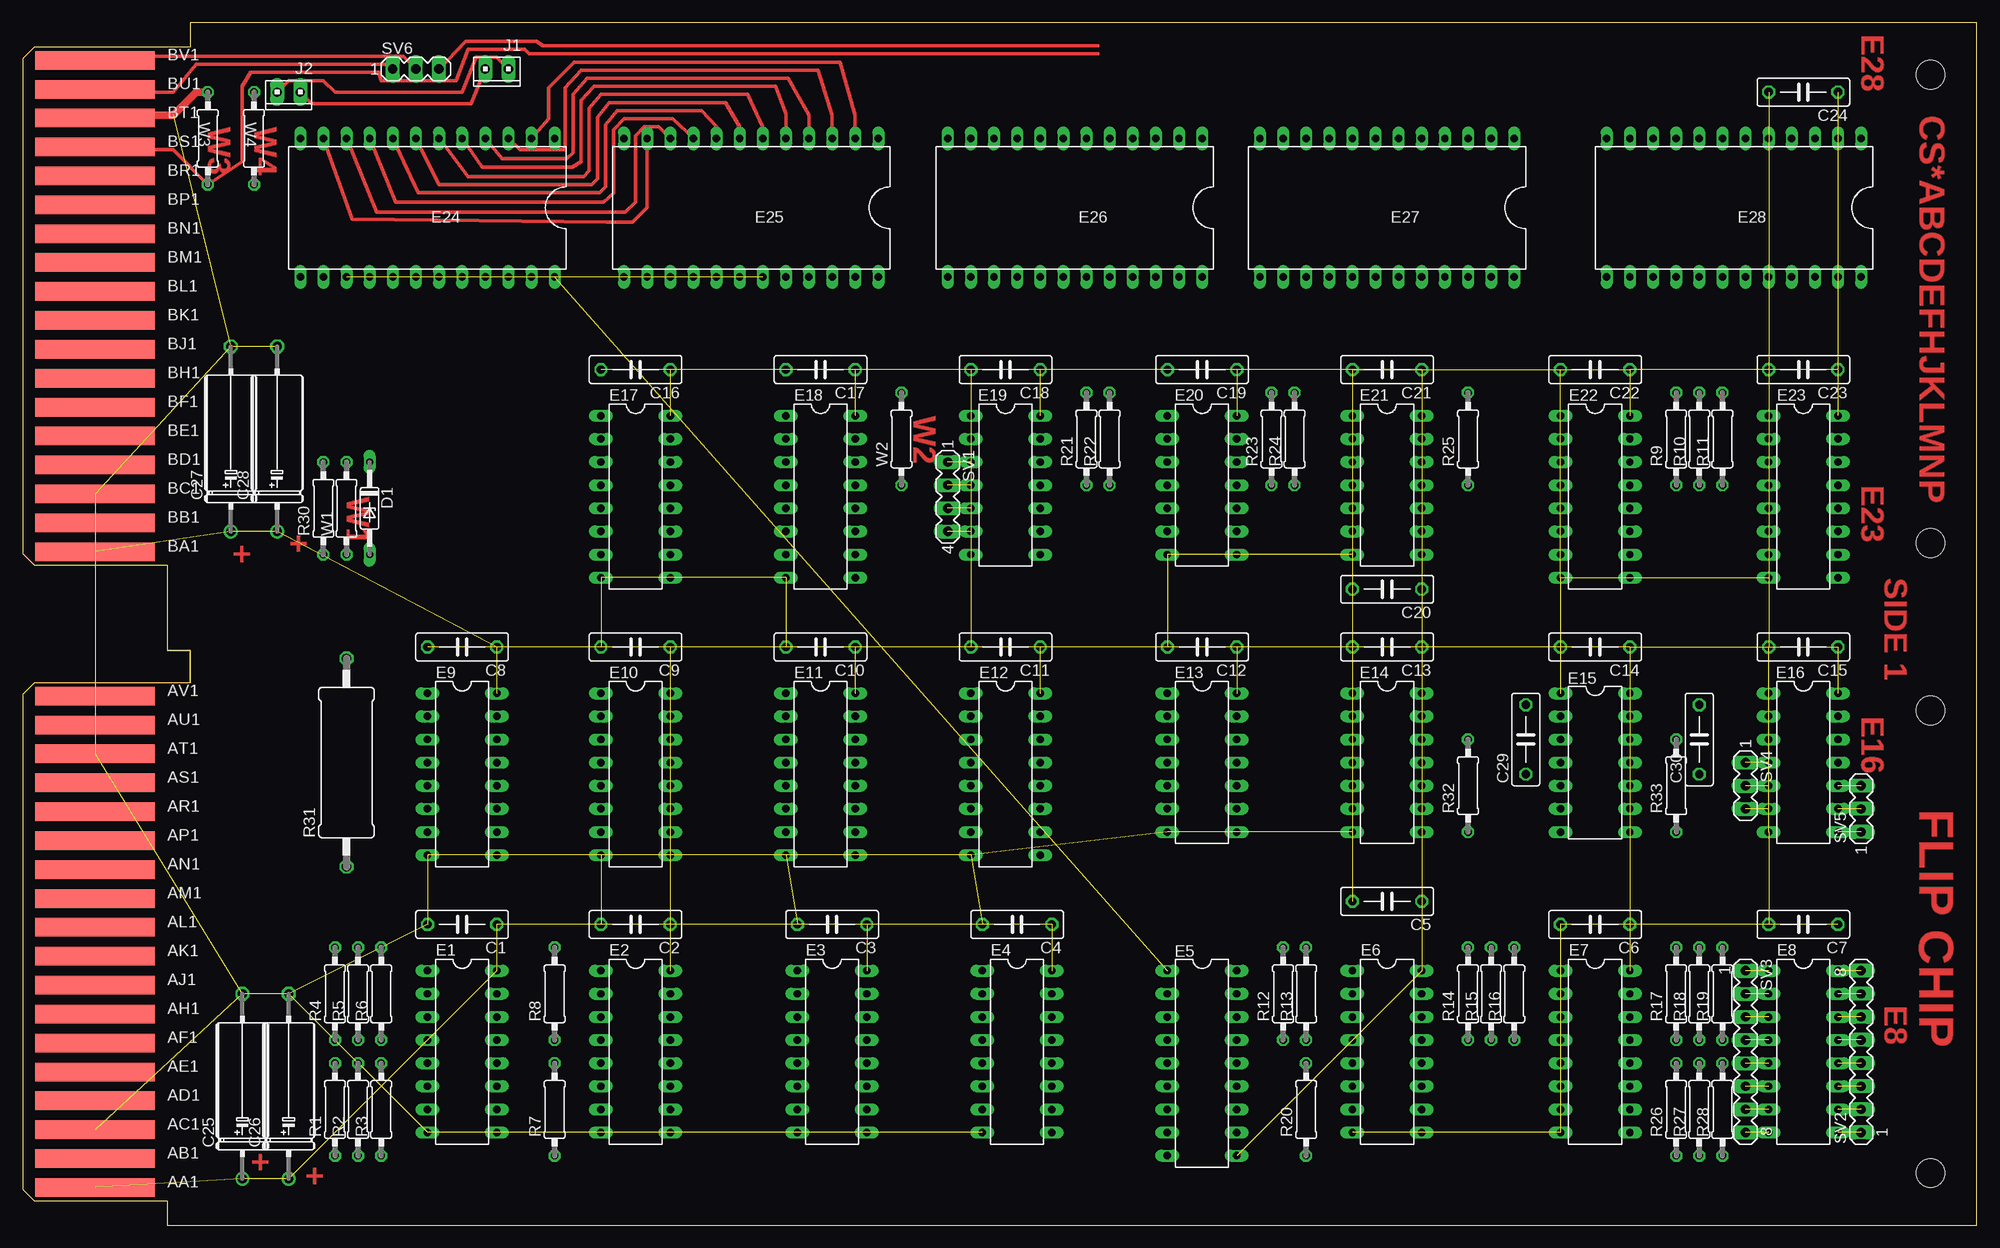
[diagram p2: board, top side]
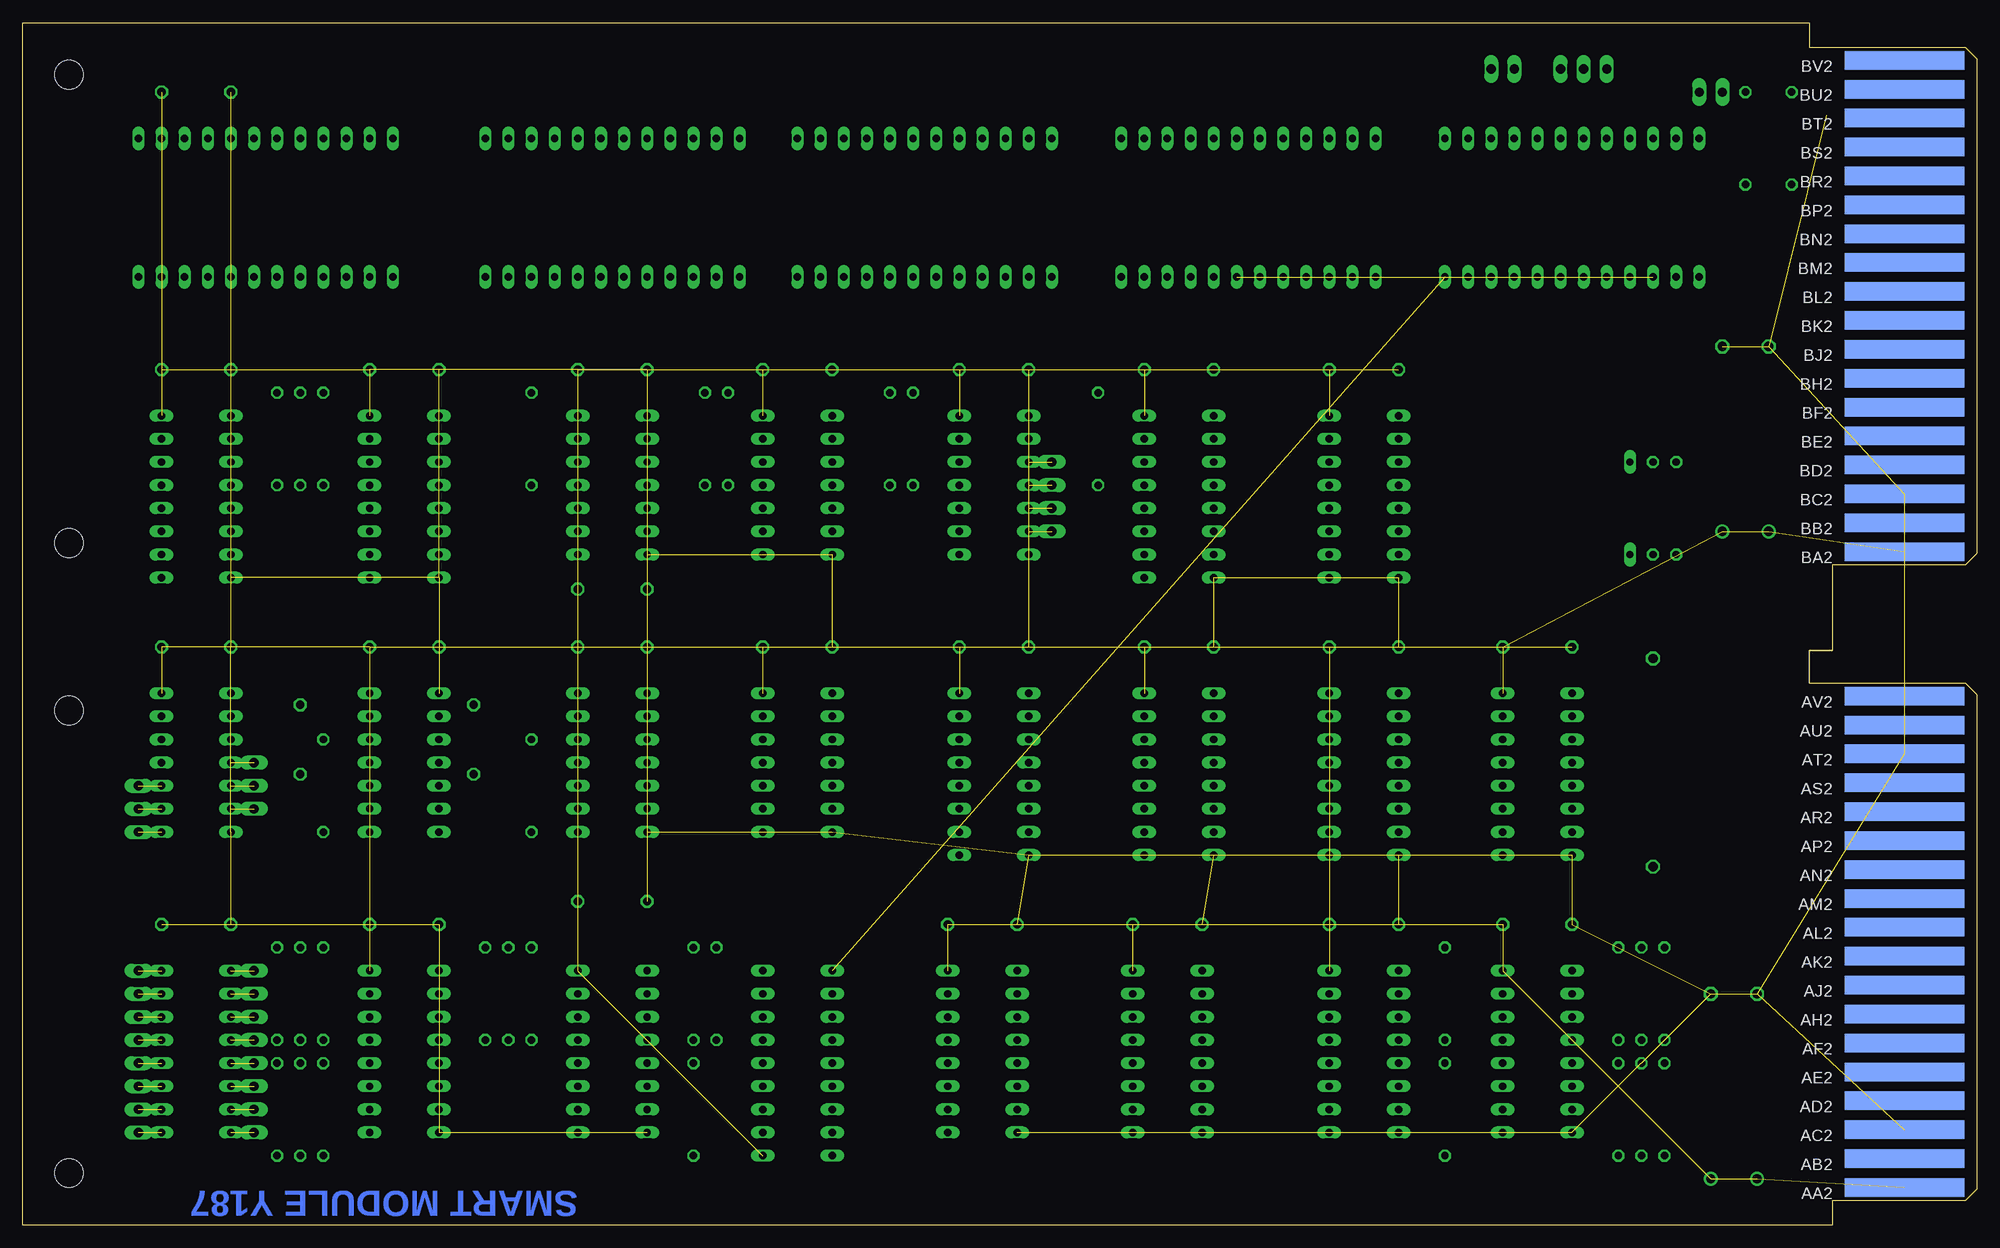
[diagram p3: board, bottom side, seen from below]

Size 214.63 x 132.08 mm. Coordinates in mm from the lower left corner, seen from the top.
Copper layers (1+16): Top 0.035mm / dielectric 1.5mm / Bottom 0.035mm
Design rules "16mils": minimum track width 16mil, minimum drill 32mil, track to track 15mil, track to pad 10mil, pad to pad 10mil, via to via 10mil, smd to smd 10mil, copper to edge 13mil, drill to drill 10mil, minimum pad ring 10mil, minimum via ring 8mil, stop-mask expansion 0mil, vias tented up to drill 0mil, thermal gap 10mil

### Footprints (pad centres in the part's own frame; a part is rotated, then mirrored left to right if it is on the bottom)
C075-032X103 = drill 0.914 octagon: 1 -3.81,0; 2 3.81,0
E12-8 = drill 1.016: + -10.16,0 | drill 1.016 octagon: - 10.16,0
DO35Z10 = drill 0.813 long: A 5.08,0; C -5.08,0
DIL16 = drill 0.813 long: 1 -8.89,-3.81; 2 -6.35,-3.81; 3 -3.81,-3.81; 4 -1.27,-3.81; 5 1.27,-3.81; 6 3.81,-3.81; 7 6.35,-3.81; 8 8.89,-3.81; 9 8.89,3.81; 10 6.35,3.81; 11 3.81,3.81; 12 1.27,3.81; 13 -1.27,3.81; 14 -3.81,3.81; 15 -6.35,3.81; 16 -8.89,3.81
DIL18 = drill 0.813 long: 1 -10.16,-3.81; 2 -7.62,-3.81; 3 -5.08,-3.81; 4 -2.54,-3.81; 5 0,-3.81; 6 2.54,-3.81; 7 5.08,-3.81; 8 7.62,-3.81; 9 10.16,-3.81; 10 10.16,3.81; 11 7.62,3.81; 12 5.08,3.81; 13 2.54,3.81; 14 0,3.81; 15 -2.54,3.81; 16 -5.08,3.81; 17 -7.62,3.81; 18 -10.16,3.81
DIL14 = drill 0.813 long: 1 -7.62,-3.81; 2 -5.08,-3.81; 3 -2.54,-3.81; 4 0,-3.81; 5 2.54,-3.81; 6 5.08,-3.81; 7 7.62,-3.81; 8 7.62,3.81; 9 5.08,3.81; 10 2.54,3.81; 11 0,3.81; 12 -2.54,3.81; 13 -5.08,3.81; 14 -7.62,3.81
DIL24 = drill 0.813 long: 1 -12.7,-7.62; 2 -10.16,-7.62; 3 -7.62,-7.62; 4 -5.08,-7.62; 5 -2.54,-7.62; 6 0,-7.62; 7 2.54,-7.62; 8 5.08,-7.62; 9 7.62,-7.62; 10 10.16,-7.62; 11 12.7,-7.62; 12 15.24,-7.62; 13 15.24,7.62; 14 12.7,7.62; 15 10.16,7.62; 16 7.62,7.62; 17 5.08,7.62; 18 2.54,7.62; 19 0,7.62; 20 -2.54,7.62; 21 -5.08,7.62; 22 -7.62,7.62; 23 -10.16,7.62; 24 -12.7,7.62
10X02MTA = drill 1.016 long: 1 1.27,0; 2 -1.27,0
0207/10 = drill 0.813 octagon: 1 -5.08,0; 2 5.08,0
0617/22 = drill 1.016 octagon: 1 -11.43,0; 2 11.43,0
MA04-1 = drill 1.016 long: 1 -3.81,0; 2 -1.27,0; 3 1.27,0; 4 3.81,0
MA08-1 = drill 1.016 long: 1 -8.89,0; 2 -6.35,0; 3 -3.81,0; 4 -1.27,0; 5 1.27,0; 6 3.81,0; 7 6.35,0; 8 8.89,0
MA03-1 = drill 1.016 long: 1 -2.54,0; 2 0,0; 3 2.54,0
DOUBLE-LONG = hole 3.175: 209.55,56.515; 209.55,5.715; 209.55,74.93; 209.55,126.365
EDGE-CON4 = smd 13.106 x 2.032: AA1 7.938,4.128; AB1 7.938,7.303; AC1 7.938,10.477; AD1 7.938,13.652; AE1 7.938,16.828; AF1 7.938,20.003; AH1 7.938,23.177; AJ1 7.938,26.352; AK1 7.938,29.527; AL1 7.938,32.703; AM1 7.938,35.877; AN1 7.938,39.053; AP1 7.938,42.227; AR1 7.938,45.403; AS1 7.938,48.578; AT1 7.938,51.752; AU1 7.938,54.928; AV1 7.938,58.102; BA1 7.938,73.978; BB1 7.938,77.153; BC1 7.938,80.328; BD1 7.938,83.502; BE1 7.938,86.677; BF1 7.938,89.853; BH1 7.938,93.028; BJ1 7.938,96.203; BK1 7.938,99.377; BL1 7.938,102.552; BM1 7.938,105.728; BN1 7.938,108.903; BP1 7.938,112.078; BR1 7.938,115.252; BS1 7.938,118.427; BT1 7.938,121.603; BU1 7.938,124.778; BV1 7.938,127.953 | smd 13.106 x 2.032 bottom: AA2 7.938,4.128; AB2 7.938,7.303; AC2 7.938,10.477; AD2 7.938,13.652; AE2 7.938,16.828; AF2 7.938,20.003; AH2 7.938,23.177; AJ2 7.938,26.352; AK2 7.938,29.527; AL2 7.938,32.703; AM2 7.938,35.877; AN2 7.938,39.053; AP2 7.938,42.227; AR2 7.938,45.403; AS2 7.938,48.578; AT2 7.938,51.752; AU2 7.938,54.928; AV2 7.938,58.102; BA2 7.938,73.978; BB2 7.938,77.153; BC2 7.938,80.328; BD2 7.938,83.502; BE2 7.938,86.677; BF2 7.938,89.853; BH2 7.938,93.028; BJ2 7.938,96.203; BK2 7.938,99.377; BL2 7.938,102.552; BM2 7.938,105.728; BN2 7.938,108.903; BP2 7.938,112.078; BR2 7.938,115.252; BS2 7.938,118.427; BT2 7.938,121.603; BU2 7.938,124.778; BV2 7.938,127.953

### Placement (x,y rotation side)
C1  48.26,33.02 180 top
C2  67.31,33.02 180 top
C3  88.9,33.02 180 top
C4  109.22,33.02 180 top
C5  149.86,35.56 180 top
C6  172.72,33.02 180 top
C7  195.58,33.02 180 top
C8  48.26,63.5 180 top
C9  67.31,63.5 180 top
C10  87.63,63.5 180 top
C11  107.95,63.5 180 top
C12  129.54,63.5 180 top
C13  149.86,63.5 180 top
C14  172.72,63.5 180 top
C15  195.58,63.5 180 top
C16  67.31,93.98 180 top
C17  87.63,93.98 180 top
C18  107.95,93.98 180 top
C19  129.54,93.98 180 top
C20  149.86,69.85 180 top
C21  149.86,93.98 180 top
C22  172.72,93.98 180 top
C23  195.58,93.98 180 top
C24  195.58,124.46 180 top
C25  24.13,15.24 90 top
C26  29.21,15.24 90 top
C27  22.86,86.36 90 top
C28  27.94,86.36 90 top
C29  165.1,53.34 90 top
C30  184.15,53.34 90 top
D1  38.1,78.74 270 top
E1  48.26,19.05 270 top
E2  67.31,19.05 270 top
E3  88.9,19.05 270 top
E4  109.22,19.05 270 top
E5  129.54,17.78 270 top
E6  149.86,19.05 270 top
E7  172.72,19.05 270 top
E8  195.58,19.05 270 top
E9  48.26,49.53 270 top
E10  67.31,49.53 270 top
E11  87.63,49.53 270 top
E12  107.95,49.53 270 top
E13  129.54,50.8 270 top
E14  149.86,50.8 270 top
E15  172.72,50.8 270 top
E16  195.58,50.8 270 top
E17  67.31,80.01 270 top
E18  87.63,80.01 270 top
E19  107.95,81.28 270 top
E20  129.54,81.28 270 top
E21  149.86,81.28 270 top
E22  172.72,80.01 270 top
E23  195.58,80.01 270 top
E24  45.72,111.76 180 top
E25  81.28,111.76 180 top
E26  116.84,111.76 180 top
E27  151.13,111.76 180 top
E28  189.23,111.76 180 top
J1  52.07,127 180 top
J2  29.21,124.46 180 top
R1  34.29,12.7 90 top
R2  36.83,12.7 90 top
R3  39.37,12.7 90 top
R4  34.29,25.4 90 top
R5  36.83,25.4 90 top
R6  39.37,25.4 90 top
R7  58.42,12.7 90 top
R8  58.42,25.4 90 top
R9  181.61,86.36 90 top
R10  184.15,86.36 90 top
R11  186.69,86.36 90 top
R12  138.43,25.4 90 top
R13  140.97,25.4 90 top
R14  158.75,25.4 90 top
R15  161.29,25.4 90 top
R16  163.83,25.4 90 top
R17  181.61,25.4 90 top
R18  184.15,25.4 90 top
R19  186.69,25.4 90 top
R20  140.97,12.7 90 top
R21  116.84,86.36 90 top
R22  119.38,86.36 90 top
R23  137.16,86.36 90 top
R24  139.7,86.36 90 top
R25  158.75,86.36 90 top
R26  181.61,12.7 90 top
R27  184.15,12.7 90 top
R28  186.69,12.7 90 top
R30  33.02,78.74 90 top
R31  35.56,50.8 90 top
R32  158.75,48.26 90 top
R33  181.61,48.26 90 top
SV1  101.6,80.01 270 top
SV2  201.93,19.05 90 top
SV3  189.23,19.05 270 top
SV4  189.23,48.26 270 top
SV5  201.93,45.72 90 top
SV6  43.18,127 0 top
U$1  0,0 0 top
U$2  0,0 0 top
W1  35.56,78.74 90 top
W2  96.52,86.36 90 top
W3  20.32,119.38 90 top
W4  25.4,119.38 90 top

### Tracks (layer width: path | path; a pad name or v marks a point on that pad's centre or on a via)
A0
  Top 0.406: E24.3 54.61,118.11 59.56,118.11 59.56,124.97 61.34,126.87 87.38,126.87 88.9,121.92 E25.3
A1
  Top 0.406: E25.2 91.44,121.92 89.79,127.76 60.58,127.76 57.79,124.97 57.79,121.54 E24.2
A5  (1 unrouted)
A6  (1 unrouted)
A7  (1 unrouted)
BS1
  Top 0.406: U$2.BS1 8.89,118.11 16.51,118.11 W3.1 24.13,116.84 24.13,125.09 25.02,126.62 39.12,126.62 39.37,125.73 47.63,125.73 48.9,129.16 55.12,129.16 55.63,128.65 118.11,128.65
BU1
  Top 0.406: U$2.BU1 8.89,124.46 16.51,124.46 19.05,127.51 40.13,127.51 SV6.1
BV1
  Top 0.406: U$2.BV1 8.89,128.4 41.78,128.4 SV6.2
GND  (52 unrouted)
  Top 0.813: U$2.BT1 7.62,121.92 16.51,121.92 19.05,124.46 W3.2
N$1
  Top 0.406: J2.1 29.21,125.73 33.02,125.73 34.29,124.46 48.26,124.46 49.78,128.27 52.07,128.27 J1.2
N$20
  Top 0.406: J2.2 31.75,123.19 49.28,123.19 J1.1
N$28
  Top 0.406: SV6.3 48.64,130.05 56.39,130.05 57.15,129.54 118.11,129.54
N$259  (1 unrouted)
N$261  (1 unrouted)
N$262  (1 unrouted)
N$264  (1 unrouted)
N$273  (1 unrouted)
N$275  (1 unrouted)
N$280  (1 unrouted)
N$402  (1 unrouted)
N$403  (1 unrouted)
N$404  (1 unrouted)
N$405  (1 unrouted)
N$406  (1 unrouted)
N$407  (1 unrouted)
N$408  (1 unrouted)
N$409  (1 unrouted)
N$410  (1 unrouted)
N$411  (1 unrouted)
N$412  (1 unrouted)
N$413  (1 unrouted)
N$414  (1 unrouted)
N$415  (1 unrouted)
N$416  (1 unrouted)
N$417  (1 unrouted)
N$452  (1 unrouted)
N$455  (1 unrouted)
N$458  (1 unrouted)
O0
  Top 0.406: E24.4 52.64,117.16 59.75,117.16 60.45,117.79 60.45,124.21 61.98,125.98 84.07,125.98 86.36,121.92 E25.4
O1
  Top 0.406: E24.5 50.48,116.2 60.33,116.2 61.34,116.84 61.34,123.57 62.74,125.09 82.68,125.09 83.82,122.05 E25.5
O2
  Top 0.406: E24.6 48.9,115.19 61.6,115.19 62.23,115.82 62.23,122.68 63.5,124.21 79.63,124.21 81.28,120.65 E25.6
O3
  Top 0.406: E24.7 45.72,114.3 62.48,114.3 63.12,114.94 63.12,121.73 64.39,123.32 77.22,123.32 78.74,120.65 E25.7
O4
  Top 0.406: E24.8 43.43,113.41 63.37,113.41 64.01,114.05 64.01,120.9 65.28,122.43 74.55,122.43 76.2,120.65 E25.8
O5
  Top 0.406: E24.9 40.96,112.39 63.82,112.39 64.9,113.35 64.9,120.33 66.04,121.54 71.37,121.54 E25.9
O6
  Top 0.406: E25.10 69.85,120.65 68.26,120.65 67.31,119.7 67.31,112.39 66.17,111.25 38.86,111.25 E24.10
O7
  Top 0.406: E24.11 36.2,110.49 64.14,110.17 66.99,110.17 68.58,111.76 E25.11
VBB  (1 unrouted)
VCC  (51 unrouted)
VDD  (1 unrouted)
VGG  (1 unrouted)

### Text on the board
Top: E28 | CS*ABCDEFHJKLMNP | W3 | W4 | W2 | E23 | W1 | + | + | SIDE 1 | E16 | FLIP CHIP | E8 | + | +
Bottom: SMART MODULE Y187